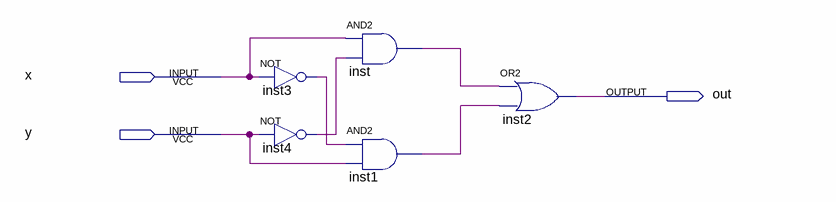
[diagram p0: schematic sheet]
// Quartus schematic de10_vid7.bdf as structural Verilog: 5 symbols, 3 pins
module de10_vid7 (
  input  x,
  input  y,
  output out
);

  wire inst1_out, inst3_out, inst4_out, inst_out;

  not inst3 (inst3_out, x);
  not inst4 (inst4_out, y);
  and inst (inst_out, x, inst4_out);
  and inst1 (inst1_out, inst3_out, y);
  or inst2 (out, inst_out, inst1_out);
endmodule
